# EAGLE design Faceg (EAGLE 6.1)
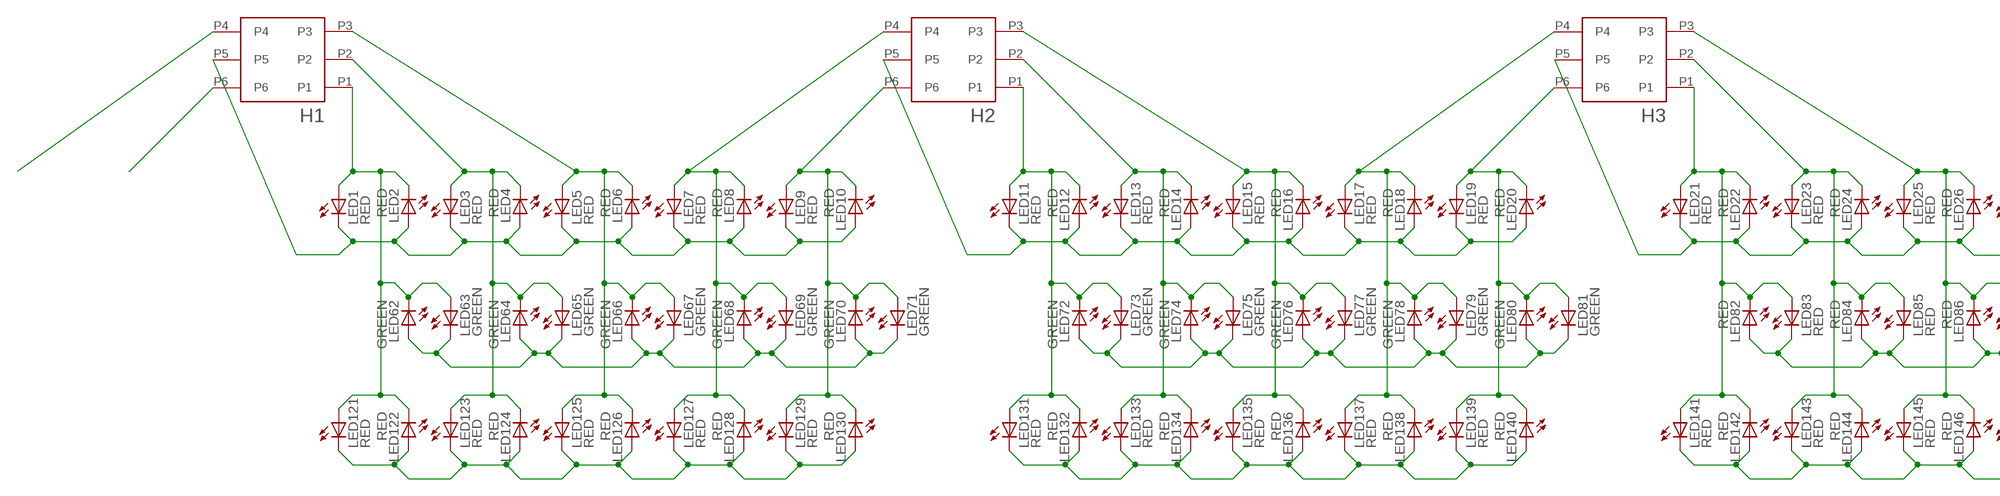
[diagram p0: schematic, sheet 1, part 1 of 2]
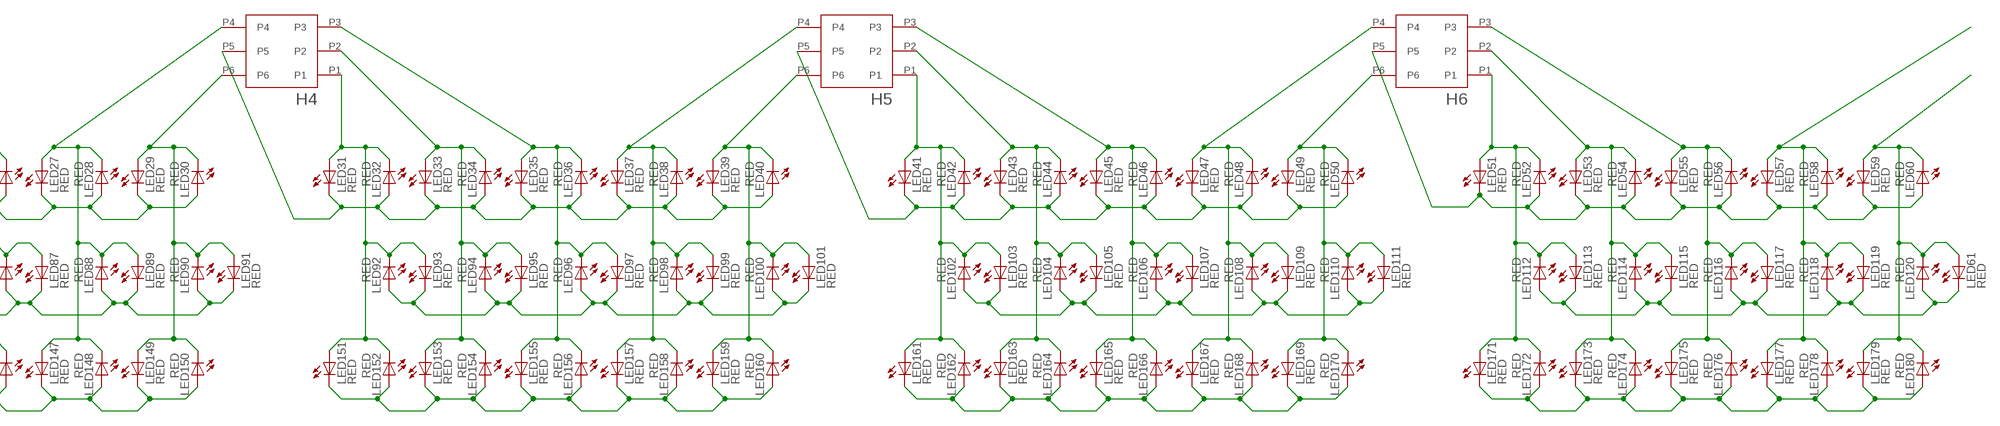
[diagram p1: schematic, sheet 1, part 2 of 2]

## Parts
H1  2X3  [3X2_1MM_SMD]
H2  2X3  [3X2_1MM_SMD]
H3  2X3  [3X2_1MM_SMD]
H4  2X3  [3X2_1MM_SMD]
H5  2X3  [3X2_1MM_SMD]
H6  2X3  [3X2_1MM_SMD]
LED1  RED  LED0603  [LED-0603]
LED2  RED  LED0603  [LED-0603]
LED3  RED  LED0603  [LED-0603]
LED4  RED  LED0603  [LED-0603]
LED5  RED  LED0603  [LED-0603]
LED6  RED  LED0603  [LED-0603]
LED7  RED  LED0603  [LED-0603]
LED8  RED  LED0603  [LED-0603]
LED9  RED  LED0603  [LED-0603]
LED10  RED  LED0603  [LED-0603]
LED11  RED  LED0603  [LED-0603]
LED12  RED  LED0603  [LED-0603]
LED13  RED  LED0603  [LED-0603]
LED14  RED  LED0603  [LED-0603]
LED15  RED  LED0603  [LED-0603]
LED16  RED  LED0603  [LED-0603]
LED17  RED  LED0603  [LED-0603]
LED18  RED  LED0603  [LED-0603]
LED19  RED  LED0603  [LED-0603]
LED20  RED  LED0603  [LED-0603]
LED21  RED  LED0603  [LED-0603]
LED22  RED  LED0603  [LED-0603]
LED23  RED  LED0603  [LED-0603]
LED24  RED  LED0603  [LED-0603]
LED25  RED  LED0603  [LED-0603]
LED26  RED  LED0603  [LED-0603]
LED27  RED  LED0603  [LED-0603]
LED28  RED  LED0603  [LED-0603]
LED29  RED  LED0603  [LED-0603]
LED30  RED  LED0603  [LED-0603]
LED31  RED  LED0603  [LED-0603]
LED32  RED  LED0603  [LED-0603]
LED33  RED  LED0603  [LED-0603]
LED34  RED  LED0603  [LED-0603]
LED35  RED  LED0603  [LED-0603]
LED36  RED  LED0603  [LED-0603]
LED37  RED  LED0603  [LED-0603]
LED38  RED  LED0603  [LED-0603]
LED39  RED  LED0603  [LED-0603]
LED40  RED  LED0603  [LED-0603]
LED41  RED  LED0603  [LED-0603]
LED42  RED  LED0603  [LED-0603]
LED43  RED  LED0603  [LED-0603]
LED44  RED  LED0603  [LED-0603]
LED45  RED  LED0603  [LED-0603]
LED46  RED  LED0603  [LED-0603]
LED47  RED  LED0603  [LED-0603]
LED48  RED  LED0603  [LED-0603]
LED49  RED  LED0603  [LED-0603]
LED50  RED  LED0603  [LED-0603]
LED51  RED  LED0603  [LED-0603]
LED52  RED  LED0603  [LED-0603]
LED53  RED  LED0603  [LED-0603]
LED54  RED  LED0603  [LED-0603]
LED55  RED  LED0603  [LED-0603]
LED56  RED  LED0603  [LED-0603]
LED57  RED  LED0603  [LED-0603]
LED58  RED  LED0603  [LED-0603]
LED59  RED  LED0603  [LED-0603]
LED60  RED  LED0603  [LED-0603]
LED61  RED  LED0603  [LED-0603]
LED62  GREEN  LED0603  [LED-0603]
LED63  GREEN  LED0603  [LED-0603]
LED64  GREEN  LED0603  [LED-0603]
LED65  GREEN  LED0603  [LED-0603]
LED66  GREEN  LED0603  [LED-0603]
LED67  GREEN  LED0603  [LED-0603]
LED68  GREEN  LED0603  [LED-0603]
LED69  GREEN  LED0603  [LED-0603]
LED70  GREEN  LED0603  [LED-0603]
LED71  GREEN  LED0603  [LED-0603]
LED72  GREEN  LED0603  [LED-0603]
LED73  GREEN  LED0603  [LED-0603]
LED74  GREEN  LED0603  [LED-0603]
LED75  GREEN  LED0603  [LED-0603]
LED76  GREEN  LED0603  [LED-0603]
LED77  GREEN  LED0603  [LED-0603]
LED78  GREEN  LED0603  [LED-0603]
LED79  GREEN  LED0603  [LED-0603]
LED80  GREEN  LED0603  [LED-0603]
LED81  GREEN  LED0603  [LED-0603]
LED82  RED  LED0603  [LED-0603]
LED83  RED  LED0603  [LED-0603]
LED84  RED  LED0603  [LED-0603]
LED85  RED  LED0603  [LED-0603]
LED86  RED  LED0603  [LED-0603]
LED87  RED  LED0603  [LED-0603]
LED88  RED  LED0603  [LED-0603]
LED89  RED  LED0603  [LED-0603]
LED90  RED  LED0603  [LED-0603]
LED91  RED  LED0603  [LED-0603]
LED92  RED  LED0603  [LED-0603]
LED93  RED  LED0603  [LED-0603]
LED94  RED  LED0603  [LED-0603]
LED95  RED  LED0603  [LED-0603]
LED96  RED  LED0603  [LED-0603]
LED97  RED  LED0603  [LED-0603]
LED98  RED  LED0603  [LED-0603]
LED99  RED  LED0603  [LED-0603]
LED100  RED  LED0603  [LED-0603]
LED101  RED  LED0603  [LED-0603]
LED102  RED  LED0603  [LED-0603]
LED103  RED  LED0603  [LED-0603]
LED104  RED  LED0603  [LED-0603]
LED105  RED  LED0603  [LED-0603]
LED106  RED  LED0603  [LED-0603]
LED107  RED  LED0603  [LED-0603]
LED108  RED  LED0603  [LED-0603]
LED109  RED  LED0603  [LED-0603]
LED110  RED  LED0603  [LED-0603]
LED111  RED  LED0603  [LED-0603]
LED112  RED  LED0603  [LED-0603]
LED113  RED  LED0603  [LED-0603]
LED114  RED  LED0603  [LED-0603]
LED115  RED  LED0603  [LED-0603]
LED116  RED  LED0603  [LED-0603]
LED117  RED  LED0603  [LED-0603]
LED118  RED  LED0603  [LED-0603]
LED119  RED  LED0603  [LED-0603]
LED120  RED  LED0603  [LED-0603]
LED121  RED  LED0603  [LED-0603]
LED122  RED  LED0603  [LED-0603]
LED123  RED  LED0603  [LED-0603]
LED124  RED  LED0603  [LED-0603]
LED125  RED  LED0603  [LED-0603]
LED126  RED  LED0603  [LED-0603]
LED127  RED  LED0603  [LED-0603]
LED128  RED  LED0603  [LED-0603]
LED129  RED  LED0603  [LED-0603]
LED130  RED  LED0603  [LED-0603]
LED131  RED  LED0603  [LED-0603]
LED132  RED  LED0603  [LED-0603]
LED133  RED  LED0603  [LED-0603]
LED134  RED  LED0603  [LED-0603]
LED135  RED  LED0603  [LED-0603]
LED136  RED  LED0603  [LED-0603]
LED137  RED  LED0603  [LED-0603]
LED138  RED  LED0603  [LED-0603]
LED139  RED  LED0603  [LED-0603]
LED140  RED  LED0603  [LED-0603]
LED141  RED  LED0603  [LED-0603]
LED142  RED  LED0603  [LED-0603]
LED143  RED  LED0603  [LED-0603]
LED144  RED  LED0603  [LED-0603]
LED145  RED  LED0603  [LED-0603]
LED146  RED  LED0603  [LED-0603]
LED147  RED  LED0603  [LED-0603]
LED148  RED  LED0603  [LED-0603]
LED149  RED  LED0603  [LED-0603]
LED150  RED  LED0603  [LED-0603]
LED151  RED  LED0603  [LED-0603]
LED152  RED  LED0603  [LED-0603]
LED153  RED  LED0603  [LED-0603]
LED154  RED  LED0603  [LED-0603]
LED155  RED  LED0603  [LED-0603]
LED156  RED  LED0603  [LED-0603]
LED157  RED  LED0603  [LED-0603]
LED158  RED  LED0603  [LED-0603]
LED159  RED  LED0603  [LED-0603]
LED160  RED  LED0603  [LED-0603]
LED161  RED  LED0603  [LED-0603]
LED162  RED  LED0603  [LED-0603]
LED163  RED  LED0603  [LED-0603]
LED164  RED  LED0603  [LED-0603]
LED165  RED  LED0603  [LED-0603]
LED166  RED  LED0603  [LED-0603]
LED167  RED  LED0603  [LED-0603]
LED168  RED  LED0603  [LED-0603]
LED169  RED  LED0603  [LED-0603]
LED170  RED  LED0603  [LED-0603]
LED171  RED  LED0603  [LED-0603]
LED172  RED  LED0603  [LED-0603]
LED173  RED  LED0603  [LED-0603]
LED174  RED  LED0603  [LED-0603]
LED175  RED  LED0603  [LED-0603]
LED176  RED  LED0603  [LED-0603]
LED177  RED  LED0603  [LED-0603]
LED178  RED  LED0603  [LED-0603]
LED179  RED  LED0603  [LED-0603]
LED180  RED  LED0603  [LED-0603]

## Nets
N$1: H1.P1 LED1.A LED2.C LED62.C LED63.A LED121.A LED122.C
N$2: H1.P2 LED3.A LED4.C LED64.C LED65.A LED123.A LED124.C
N$3: H1.P3 LED5.A LED6.C LED66.C LED67.A LED125.A LED126.C
N$4: H2.P4 LED7.A LED8.C LED68.C LED69.A LED127.A LED128.C
N$5: H2.P6 LED9.A LED10.C LED70.C LED71.A LED129.A LED130.C
N$6: H2.P1 LED11.A LED12.C LED72.C LED73.A LED131.A LED132.C
N$7: H2.P2 LED13.A LED14.C LED74.C LED75.A LED133.A LED134.C
N$8: H2.P3 LED15.A LED16.C LED76.C LED77.A LED135.A LED136.C
N$9: H3.P4 LED17.A LED18.C LED78.C LED79.A LED137.A LED138.C
N$10: H3.P6 LED19.A LED20.C LED80.C LED81.A LED139.A LED140.C
N$11: H3.P1 LED21.A LED22.C LED82.C LED83.A LED141.A LED142.C
N$12: H3.P2 LED23.A LED24.C LED84.C LED85.A LED143.A LED144.C
N$13: H3.P3 LED25.A LED26.C LED86.C LED87.A LED145.A LED146.C
N$14: H4.P4 LED27.A LED28.C LED88.C LED89.A LED147.A LED148.C
N$15: H4.P6 LED29.A LED30.C LED90.C LED91.A LED149.A LED150.C
N$16: H4.P1 LED31.A LED32.C LED92.C LED93.A LED151.A LED152.C
N$17: H4.P2 LED33.A LED34.C LED94.C LED95.A LED153.A LED154.C
N$18: H4.P3 LED35.A LED36.C LED96.C LED97.A LED155.A LED156.C
N$19: H5.P4 LED37.A LED38.C LED98.C LED99.A LED157.A LED158.C
N$20: H5.P6 LED39.A LED40.C LED100.C LED101.A LED159.A LED160.C
N$21: H5.P1 LED41.A LED42.C LED102.C LED103.A LED161.A LED162.C
N$22: H5.P2 LED43.A LED44.C LED104.C LED105.A LED163.A LED164.C
N$23: H5.P3 LED45.A LED46.C LED106.C LED107.A LED165.A LED166.C
N$24: H6.P4 LED47.A LED48.C LED108.C LED109.A LED167.A LED168.C
N$25: H6.P6 LED49.A LED50.C LED110.C LED111.A LED169.A LED170.C
N$26: H6.P1 LED51.A LED52.C LED112.C LED113.A LED171.A LED172.C
N$27: H6.P2 LED53.A LED54.C LED114.C LED115.A LED173.A LED174.C
N$28: H6.P3 LED55.A LED56.C LED116.C LED117.A LED175.A LED176.C
N$29: H1.P4 LED57.A LED58.C LED118.C LED119.A LED177.A LED178.C
N$30: H1.P6 LED59.A LED60.C LED61.A LED120.C LED179.A LED180.C
N$31: LED121.C LED122.A LED123.C LED124.A LED125.C LED126.A LED127.C LED128.A LED129.C LED130.A
N$91: H1.P5 LED1.C LED2.A LED3.C LED4.A LED5.C LED6.A LED7.C LED8.A LED9.C LED10.A
N$96: H2.P5 LED11.C LED12.A LED13.C LED14.A LED15.C LED16.A LED17.C LED18.A LED19.C LED20.A
N$101: H3.P5 LED21.C LED22.A LED23.C LED24.A LED25.C LED26.A LED27.C LED28.A LED29.C LED30.A
N$106: H4.P5 LED31.C LED32.A LED33.C LED34.A LED35.C LED36.A LED37.C LED38.A LED39.C LED40.A
N$111: H5.P5 LED41.C LED42.A LED43.C LED44.A LED45.C LED46.A LED47.C LED48.A LED49.C LED50.A
N$116: H6.P5 LED51.C LED52.A LED53.C LED54.A LED55.C LED56.A LED57.C LED58.A LED59.C LED60.A
N$121: LED62.A LED63.C LED64.A LED65.C LED66.A LED67.C LED68.A LED69.C LED70.A LED71.C
N$126: LED72.A LED73.C LED74.A LED75.C LED76.A LED77.C LED78.A LED79.C LED80.A LED81.C
N$131: LED82.A LED83.C LED84.A LED85.C LED86.A LED87.C LED88.A LED89.C LED90.A LED91.C
N$136: LED92.A LED93.C LED94.A LED95.C LED96.A LED97.C LED98.A LED99.C LED100.A LED101.C
N$141: LED102.A LED103.C LED104.A LED105.C LED106.A LED107.C LED108.A LED109.C LED110.A LED111.C
N$146: LED61.C LED112.A LED113.C LED114.A LED115.C LED116.A LED117.C LED118.A LED119.C LED120.A
N$156: LED131.C LED132.A LED133.C LED134.A LED135.C LED136.A LED137.C LED138.A LED139.C LED140.A
N$161: LED141.C LED142.A LED143.C LED144.A LED145.C LED146.A LED147.C LED148.A LED149.C LED150.A
N$166: LED151.C LED152.A LED153.C LED154.A LED155.C LED156.A LED157.C LED158.A LED159.C LED160.A
N$171: LED161.C LED162.A LED163.C LED164.A LED165.C LED166.A LED167.C LED168.A LED169.C LED170.A
N$176: LED171.C LED172.A LED173.C LED174.A LED175.C LED176.A LED177.C LED178.A LED179.C LED180.A

## Library data of the parts
H1-H6 = Customs:2X3
LED1-LED180 = SparkFun-LED:LED: LEDs Standard schematic elements and footprints for 5mm, 3mm, 1206, and 0603 sized LEDs. 5mm - Spark Fun Electronics SKU : COM-00529 (and others)

## Board
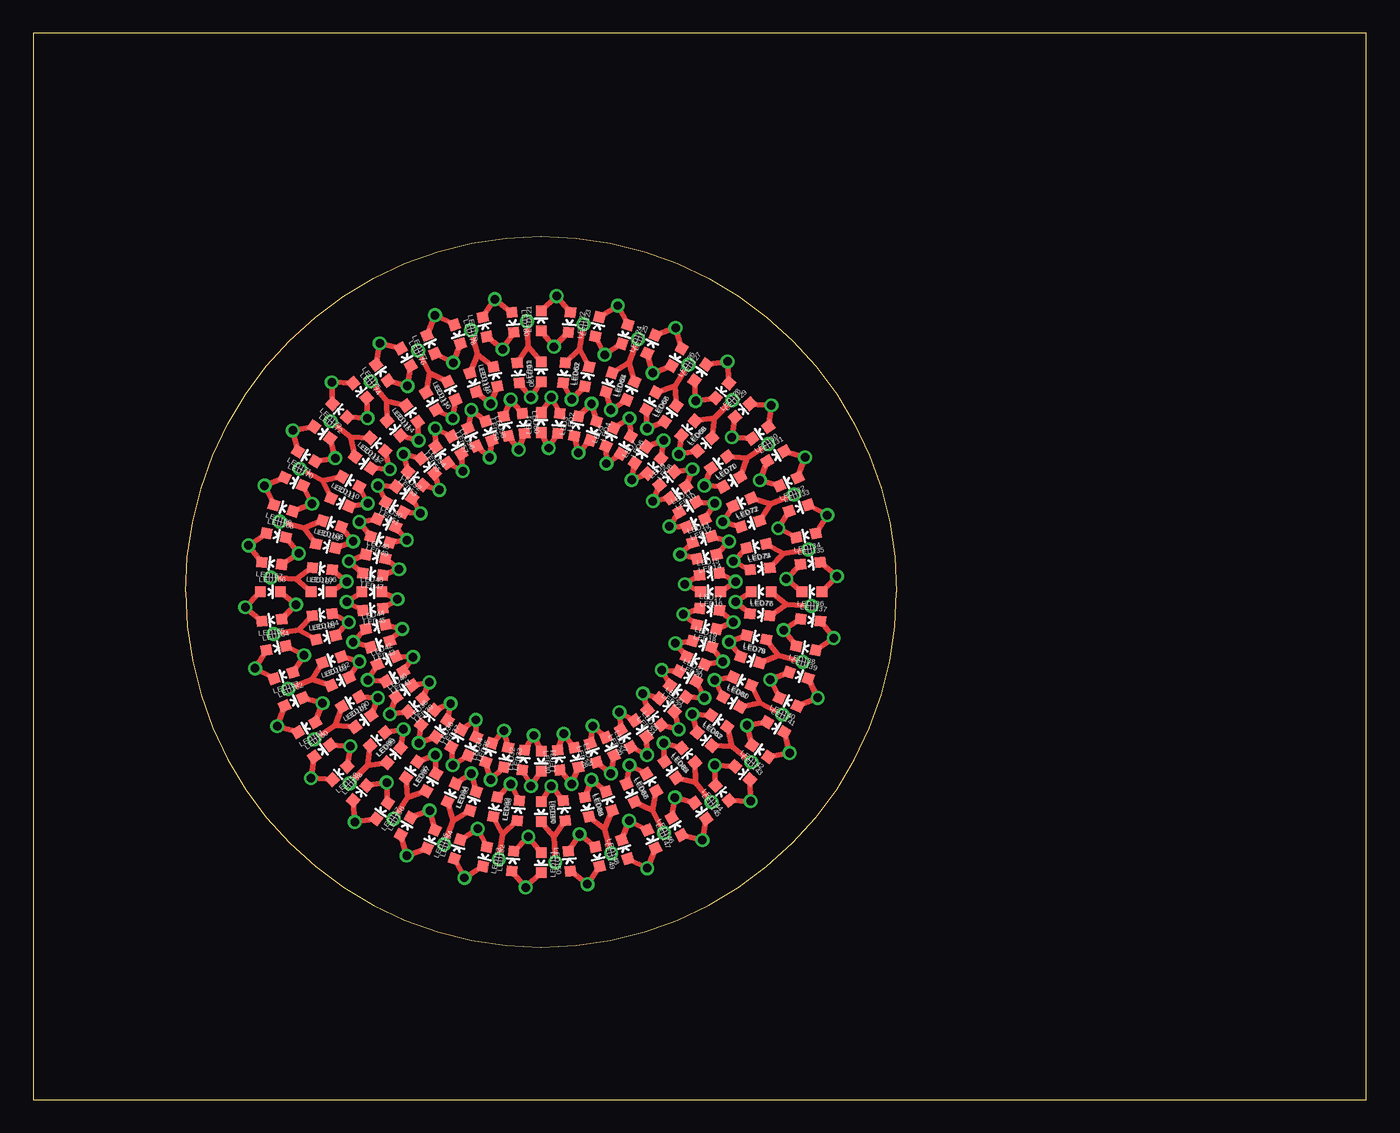
[diagram p2: board, top side]
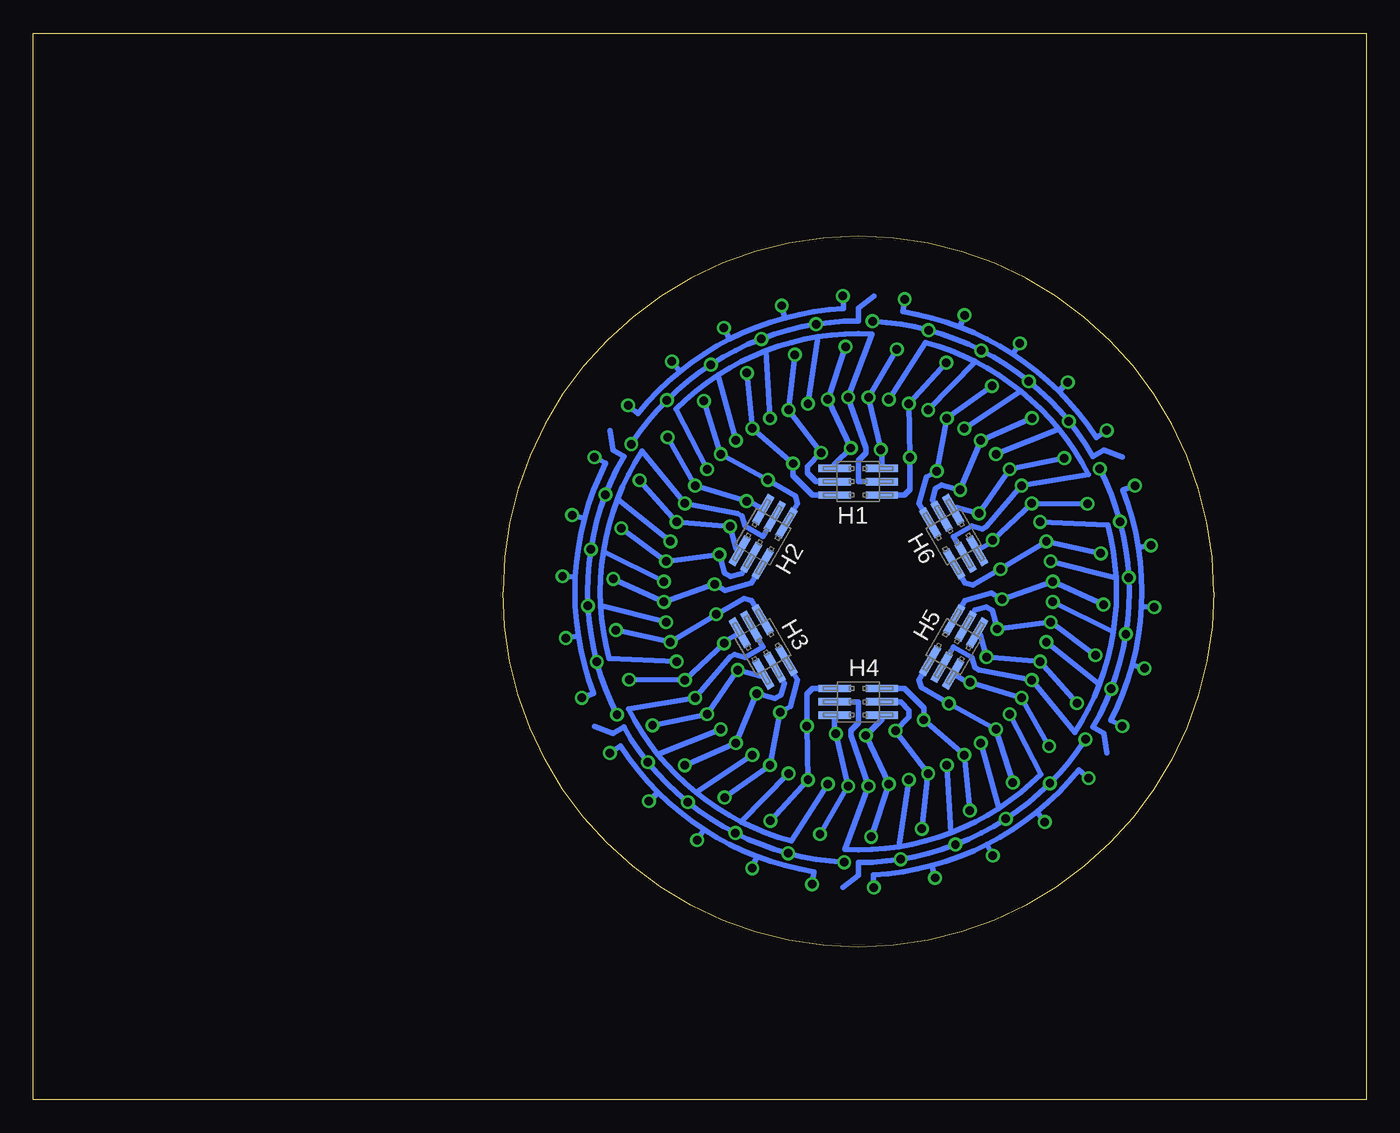
[diagram p3: board, bottom side, seen from below]

Size 100 x 80 mm. Coordinates in mm from the lower left corner, seen from the top.
Outline: 0,0 100,0 100,80 0,80 0,0
Outline: 11.43,38.1 arc180 64.77,38.1 arc180 11.43,38.1
Copper layers (1*16): Top 0.035mm / dielectric 1.5mm / Bottom 0.035mm
Design rules: minimum track width 10mil, minimum drill 24mil, track to track 8mil, track to pad 8mil, pad to pad 8mil, via to via 8mil, smd to smd 8mil, copper to edge 40mil, drill to drill 8mil, minimum pad ring 10mil, minimum via ring 8mil, stop-mask expansion 4mil, vias tented up to drill 0mil, thermal gap 10mil

### Footprints (pad centres in the part's own frame; a part is rotated, then mirrored left to right if it is on the bottom)
3X2_1MM_SMD = smd 2.413 x 0.559: P1 -1.778,1; P2 -1.778,0; P3 -1.778,-1; P4 1.778,-1; P5 1.778,0; P6 1.778,1
LED-0603 = smd 0.8 x 0.8: A 0,-0.75; C 0,0.75

### Placement (x,y rotation side)
H1  38.1,46.35 0 bottom
H2  45.25,42.23 60 bottom
H3  45.25,33.97 120 bottom
H4  38.1,29.85 180 bottom
H5  30.95,33.97 240 bottom
H6  30.95,42.23 300 bottom
LED1  38.1,50.8 0 top
LED2  39.43,50.73 174 top
LED3  40.74,50.52 348 top
LED4  42.02,50.18 162 top
LED5  43.27,49.7 336 top
LED6  44.45,49.1 150 top
LED7  45.56,48.37 324 top
LED8  46.6,47.54 138 top
LED9  47.54,46.6 312 top
LED10  48.37,45.56 126 top
LED11  49.1,44.45 300 top
LED12  49.7,43.27 114 top
LED13  50.18,42.02 288 top
LED14  50.52,40.74 102 top
LED15  50.73,39.43 276 top
LED16  50.8,38.1 90 top
LED17  50.73,36.77 264 top
LED18  50.52,35.46 78 top
LED19  50.18,34.18 252 top
LED20  49.7,32.93 66 top
LED21  49.1,31.75 240 top
LED22  48.37,30.64 54 top
LED23  47.54,29.6 228 top
LED24  46.6,28.66 42 top
LED25  45.56,27.83 216 top
LED26  44.45,27.1 30 top
LED27  43.27,26.5 204 top
LED28  42.02,26.02 18 top
LED29  40.74,25.68 192 top
LED30  39.43,25.47 6 top
LED31  38.1,25.4 180 top
LED32  36.77,25.47 354 top
LED33  35.46,25.68 168 top
LED34  34.18,26.02 342 top
LED35  32.93,26.5 156 top
LED36  31.75,27.1 330 top
LED37  30.64,27.83 144 top
LED38  29.6,28.66 318 top
LED39  28.66,29.6 132 top
LED40  27.83,30.64 306 top
LED41  27.1,31.75 120 top
LED42  26.5,32.93 294 top
LED43  26.02,34.18 108 top
LED44  25.68,35.46 282 top
LED45  25.47,36.77 96 top
LED46  25.4,38.1 270 top
LED47  25.47,39.43 84 top
LED48  25.68,40.74 258 top
LED49  26.02,42.02 72 top
LED50  26.5,43.27 246 top
LED51  27.1,44.45 60 top
LED52  27.83,45.56 234 top
LED53  28.66,46.6 48 top
LED54  29.6,47.54 222 top
LED55  30.64,48.37 36 top
LED56  31.75,49.1 210 top
LED57  32.93,49.7 24 top
LED58  34.18,50.18 198 top
LED59  35.46,50.52 12 top
LED60  36.77,50.73 186 top
LED61  38.1,54.61 0 top
LED62  39.83,54.52 174 top
LED63  41.53,54.25 348 top
LED64  43.2,53.8 162 top
LED65  44.82,53.18 336 top
LED66  46.35,52.4 150 top
LED67  47.8,51.46 324 top
LED68  49.15,50.37 138 top
LED69  50.37,49.15 312 top
LED70  51.46,47.8 126 top
LED71  52.4,46.36 300 top
LED72  53.18,44.82 114 top
LED73  53.8,43.2 288 top
LED74  54.25,41.53 102 top
LED75  54.52,39.83 276 top
LED76  54.61,38.1 90 top
LED77  54.52,36.37 264 top
LED78  54.25,34.67 78 top
LED79  53.8,33 252 top
LED80  53.18,31.38 66 top
LED81  52.4,29.84 240 top
LED82  51.46,28.4 54 top
LED83  50.37,27.05 228 top
LED84  49.15,25.83 42 top
LED85  47.8,24.74 216 top
LED86  46.35,23.8 30 top
LED87  44.82,23.02 204 top
LED88  43.2,22.4 18 top
LED89  41.53,21.95 192 top
LED90  39.83,21.68 6 top
LED91  38.1,21.59 180 top
LED92  36.37,21.68 354 top
LED93  34.67,21.95 168 top
LED94  33,22.4 342 top
LED95  31.38,23.02 156 top
LED96  29.84,23.8 330 top
LED97  28.4,24.74 144 top
LED98  27.05,25.83 318 top
LED99  25.83,27.05 132 top
LED100  24.74,28.4 306 top
LED101  23.8,29.84 120 top
LED102  23.02,31.38 294 top
LED103  22.4,33 108 top
LED104  21.95,34.67 282 top
LED105  21.68,36.37 96 top
LED106  21.59,38.1 270 top
LED107  21.68,39.83 84 top
LED108  21.95,41.53 258 top
LED109  22.4,43.2 72 top
LED110  23.02,44.82 246 top
LED111  23.8,46.36 60 top
LED112  24.74,47.8 234 top
LED113  25.83,49.15 48 top
LED114  27.05,50.37 222 top
LED115  28.4,51.46 36 top
LED116  29.85,52.4 210 top
LED117  31.38,53.18 24 top
LED118  33,53.8 198 top
LED119  34.67,54.25 12 top
LED120  36.37,54.52 186 top
LED121  38.1,58.42 0 top
LED122  40.22,58.31 174 top
LED123  42.32,57.98 348 top
LED124  44.38,57.43 162 top
LED125  46.36,56.66 336 top
LED126  48.26,55.7 150 top
LED127  50.04,54.54 324 top
LED128  51.7,53.2 138 top
LED129  53.2,51.7 312 top
LED130  54.54,50.04 126 top
LED131  55.7,48.26 300 top
LED132  56.66,46.36 114 top
LED133  57.43,44.38 288 top
LED134  57.98,42.32 102 top
LED135  58.31,40.22 276 top
LED136  58.42,38.1 90 top
LED137  58.31,35.98 264 top
LED138  57.98,33.88 78 top
LED139  57.43,31.82 252 top
LED140  56.66,29.84 66 top
LED141  55.7,27.94 240 top
LED142  54.54,26.16 54 top
LED143  53.2,24.5 228 top
LED144  51.7,23 42 top
LED145  50.04,21.66 216 top
LED146  48.26,20.5 30 top
LED147  46.36,19.54 204 top
LED148  44.38,18.77 18 top
LED149  42.32,18.22 192 top
LED150  40.22,17.89 6 top
LED151  38.1,17.78 180 top
LED152  35.98,17.89 354 top
LED153  33.88,18.22 168 top
LED154  31.82,18.77 342 top
LED155  29.84,19.54 156 top
LED156  27.94,20.5 330 top
LED157  26.16,21.66 144 top
LED158  24.5,23 318 top
LED159  23,24.5 132 top
LED160  21.66,26.16 306 top
LED161  20.5,27.94 120 top
LED162  19.54,29.84 294 top
LED163  18.77,31.82 108 top
LED164  18.22,33.88 282 top
LED165  17.89,35.98 96 top
LED166  17.78,38.1 270 top
LED167  17.89,40.22 84 top
LED168  18.22,42.32 258 top
LED169  18.77,44.38 72 top
LED170  19.54,46.36 246 top
LED171  20.5,48.26 60 top
LED172  21.66,50.04 234 top
LED173  23,51.7 48 top
LED174  24.5,53.2 222 top
LED175  26.16,54.54 36 top
LED176  27.94,55.7 210 top
LED177  29.84,56.66 24 top
LED178  31.82,57.43 198 top
LED179  33.88,57.98 12 top
LED180  35.98,58.31 186 top

### Tracks (layer width: path | path; a pad name or v marks a point on that pad's centre or on a via)
N$1  (via drill 0.64)
  Top 0.406: LED63.A v40.38,52.52 LED62.C | LED1.A v38.66,48.88 LED2.C | LED121.A v39.06,56.49 LED122.C
  Bottom 0.406: v39.06,56.49 v40.38,52.52 v38.66,48.88 39.88,47.67 H1.P1
N$2  (via drill 0.64)
  Top 0.406: LED4.C v40.89,48.53 LED3.A | LED124.C v42.87,55.89 LED123.A | LED65.A v43.33,51.73 LED64.C
  Bottom 0.406: v42.87,55.89 v43.33,51.73 v40.89,48.53 41.91,47.51 41.91,46.99 41.27,46.35 H1.P2
N$3  (via drill 0.64)
  Top 0.406: LED5.A v43,47.72 LED6.C | LED125.A v46.46,54.51 LED126.C | LED66.C v46.05,50.35 LED67.A
  Bottom 0.406: v46.46,54.51 v46.05,50.35 v43,47.72 43,46.81 41.55,45.35 H1.P3
N$4  (via drill 0.64)
  Top 0.406: LED7.A v44.89,46.49 LED8.C | LED127.A v49.69,52.41 LED128.C | LED68.C v48.43,48.43 LED69.A
  Bottom 0.406: v49.69,52.41 v48.43,48.43 v44.89,46.49 42.82,45.29 42.66,44.71 H2.P4
N$5  (via drill 0.64)
  Top 0.406: LED9.A v46.49,44.89 LED10.C | LED129.A v52.41,49.69 LED130.C | LED70.C v50.35,46.05 LED71.A
  Bottom 0.406: v52.41,49.69 v50.35,46.05 v46.49,44.89 46.37,44.93 H2.P6
N$6  (via drill 0.64)
  Top 0.406: LED11.A v47.72,43 LED12.C | LED132.C v54.51,46.46 LED131.A | LED72.C v51.73,43.33 LED73.A
  Bottom 0.406: v54.51,46.46 v51.73,43.33 v47.72,43 47.27,41.34 H2.P1
N$7  (via drill 0.64)
  Top 0.406: LED13.A v48.53,40.89 LED14.C | LED133.A v55.89,42.87 LED134.C | LED74.C v52.52,40.38 LED75.A
  Bottom 0.406: v55.89,42.87 v52.52,40.38 v48.53,40.89 48.16,39.51 47.7,39.24 46.84,39.48 H2.P2
N$8  (via drill 0.64)
  Top 0.406: LED15.A v48.88,38.66 LED16.C | LED135.A v56.49,39.06 LED136.C | LED76.C v52.69,37.34 LED77.A
  Bottom 0.406: v56.49,39.06 v52.69,37.34 v48.88,38.66 48.09,38.21 46.11,38.74 H2.P3
N$9  (via drill 0.64)
  Top 0.406: LED17.A v48.76,36.41 LED18.C | LED137.A v56.29,35.22 LED138.C | LED78.C v52.21,34.32 LED79.A
  Bottom 0.406: v56.29,35.22 v52.21,34.32 v48.76,36.41 46.68,37.61 46.11,37.46 H3.P4
N$10  (via drill 0.64)
  Top 0.406: LED19.A v48.18,34.23 LED20.C | LED139.A v55.29,31.5 LED140.C | LED80.C v51.11,31.47 LED81.A
  Bottom 0.406: v55.29,31.5 v51.11,31.47 v48.18,34.23 48.15,34.35 H3.P6
N$11  (via drill 0.64)
  Top 0.406: LED21.A v47.15,32.22 LED22.C | LED141.A v53.54,28.07 LED142.C | LED82.C v49.45,28.91 LED83.A
  Bottom 0.406: v53.54,28.07 v49.45,28.91 v47.15,32.22 45.5,31.78 H3.P1
N$12  (via drill 0.64)
  Top 0.406: LED23.A v45.73,30.47 LED24.C | LED143.A v51.12,25.08 LED144.C | LED84.C v47.29,26.75 LED85.A
  Bottom 0.406: v51.12,25.08 v47.29,26.75 v45.73,30.47 44.34,30.09 43.89,30.36 43.66,31.22 H3.P2
N$13  (via drill 0.64)
  Top 0.406: LED25.A v43.98,29.05 LED26.C | LED145.A v48.13,22.66 LED146.C | LED86.C v44.73,25.09 LED87.A
  Bottom 0.406: v48.13,22.66 v44.73,25.09 v43.98,29.05 43.19,29.5 42.66,31.49 H3.P3
N$14  (via drill 0.64)
  Top 0.406: LED27.A v41.97,28.02 LED28.C | LED147.A v44.7,20.91 LED148.C | LED88.C v41.88,23.99 LED89.A
  Bottom 0.406: v44.7,20.91 v41.88,23.99 v41.97,28.02 41.97,30.42 41.55,30.84 H4.P4
N$15  (via drill 0.64)
  Top 0.406: LED29.A v39.79,27.44 LED30.C | LED149.A v40.98,19.91 LED150.C | LED90.C v38.86,23.52 LED91.A
  Bottom 0.406: v40.98,19.91 v38.86,23.52 v39.79,27.44 39.88,27.53 H4.P6
N$16  (via drill 0.64)
  Top 0.406: LED31.A v37.53,27.32 LED32.C | LED151.A v37.14,19.71 LED152.C | LED92.C v35.81,23.68 LED93.A
  Bottom 0.406: v37.14,19.71 v35.81,23.68 v37.53,27.32 36.32,28.53 H4.P1
N$17  (via drill 0.64)
  Top 0.406: LED33.A v35.31,27.67 LED34.C | LED153.A v33.33,20.31 LED154.C | LED94.C v32.87,24.46 LED95.A
  Bottom 0.406: v33.33,20.31 v32.87,24.46 v35.31,27.67 34.29,28.69 34.29,29.21 34.92,29.84 H4.P2
N$18  (via drill 0.64)
  Top 0.406: LED35.A v33.2,28.48 LED36.C | LED156.C v29.74,21.69 LED155.A | LED96.C v30.15,25.85 LED97.A
  Bottom 0.406: v29.74,21.69 v30.15,25.85 v33.2,28.48 33.2,29.39 34.66,30.84 H4.P3
N$19  (via drill 0.64)
  Top 0.406: LED37.A v31.31,29.71 LED38.C | LED157.A v26.51,23.79 LED158.C | LED98.C v27.77,27.77 LED99.A
  Bottom 0.406: v26.51,23.79 v27.77,27.77 v31.31,29.71 33.38,30.91 33.54,31.49 H5.P4
N$20  (via drill 0.64)
  Top 0.406: LED39.A v29.71,31.31 LED40.C | LED159.A v23.79,26.51 LED160.C | LED100.C v25.85,30.15 LED101.A
  Bottom 0.406: v23.79,26.51 v25.85,30.15 v29.71,31.31 29.83,31.27 H5.P6
N$21  (via drill 0.64)
  Top 0.406: LED41.A v28.48,33.2 LED42.C | LED161.A v21.69,29.74 LED162.C | LED103.A v24.46,32.87 LED102.C
  Bottom 0.406: v21.69,29.74 v24.46,32.87 v28.48,33.2 28.93,34.86 H5.P1
N$22  (via drill 0.64)
  Top 0.406: LED43.A v27.67,35.31 LED44.C | LED164.C v20.31,33.33 LED163.A | LED105.A v23.68,35.81 LED104.C
  Bottom 0.406: v20.31,33.33 v23.68,35.81 v27.67,35.31 28.05,36.69 28.5,36.95 29.36,36.72 H5.P2
N$23  (via drill 0.64)
  Top 0.406: LED46.C v27.32,37.53 LED45.A | LED166.C v19.71,37.14 LED165.A | LED106.C v23.52,38.86 LED107.A
  Bottom 0.406: v19.71,37.14 v23.52,38.86 v27.32,37.53 28.11,37.99 30.09,37.46 H5.P3
N$24  (via drill 0.64)
  Top 0.406: LED48.C v27.44,39.79 LED47.A | LED168.C v19.91,40.98 LED167.A | LED109.A v23.99,41.88 LED108.C
  Bottom 0.406: v19.91,40.98 v23.99,41.88 v27.44,39.79 29.52,38.59 30.09,38.74 H6.P4
N$25  (via drill 0.64)
  Top 0.406: LED50.C v28.02,41.97 LED49.A | LED170.C v20.91,44.7 LED169.A | LED111.A v25.09,44.73 LED110.C
  Bottom 0.406: v20.91,44.7 v25.09,44.73 v28.02,41.97 28.05,41.85 H6.P6
N$26  (via drill 0.64)
  Top 0.406: LED52.C v29.05,43.98 LED51.A | LED172.C v22.66,48.13 LED171.A | LED113.A v26.75,47.29 LED112.C
  Bottom 0.406: v22.66,48.13 v26.75,47.29 v29.05,43.98 30.7,44.42 H6.P1
N$27  (via drill 0.64)
  Top 0.406: LED54.C v30.47,45.73 LED53.A | LED173.A v25.08,51.12 LED174.C | LED115.A v28.91,49.45 LED114.C
  Bottom 0.406: v25.08,51.12 v28.91,49.45 v30.47,45.73 31.86,46.1 32.31,45.84 32.54,44.98 H6.P2
N$28  (via drill 0.64)
  Top 0.406: LED56.C v32.22,47.15 LED55.A | LED176.C v28.07,53.54 LED175.A | LED117.A v31.47,51.11 LED116.C
  Bottom 0.406: v28.07,53.54 v31.47,51.11 v32.22,47.15 33.01,46.7 33.54,44.71 H6.P3
N$29  (via drill 0.64)
  Top 0.406: LED58.C v34.23,48.18 LED57.A | LED178.C v31.5,55.29 LED177.A | LED119.A v34.32,52.21 LED118.C
  Bottom 0.406: v31.5,55.29 v34.32,52.21 v34.23,48.18 34.23,45.78 34.66,45.35 H1.P4
N$30  (via drill 0.64)
  Top 0.406: LED59.A v36.41,48.76 LED60.C | LED180.C v35.22,56.29 LED179.A | LED61.A v37.34,52.69 LED120.C
  Bottom 0.406: v35.22,56.29 v37.34,52.69 v36.41,48.76 36.32,48.67 H1.P6
N$31  (via drill 0.64)
  Top 0.406: LED121.C v39.26,60.3 LED122.A | LED123.C v43.85,59.57 LED124.A | LED126.A v48.19,57.9 LED125.C | LED128.A v52.09,55.37 LED127.C | LED129.C v55.37,52.09 LED130.A
  Bottom 0.406: v39.26,60.3 39.21,59.34 arc-12 43.61,58.65 | v43.85,59.57 43.61,58.65 | v48.19,57.9 47.76,57.05 | v52.09,55.37 51.49,54.63 | v55.37,52.09 54.63,51.49 arc12 51.49,54.63 | 43.61,58.65 arc-12 47.76,57.05 | 51.49,54.63 arc12 47.76,57.05
N$91  (via drill 0.64)
  Top 0.406: LED1.C v38.86,52.69 LED2.A | LED3.C v41.88,52.21 LED4.A | LED5.C v44.73,51.11 LED6.A | LED7.C v47.29,49.45 LED8.A | LED10.A v49.45,47.29 LED9.C
  Bottom 0.406: v41.88,52.21 41.13,57.23 | v44.73,51.11 45.04,56.18 | v47.29,49.45 48.65,54.34 | v49.45,47.29 51.8,51.8 arc12 48.65,54.34 | 41.13,57.23 arc12 37.09,57.44 v38.86,52.69 37.53,48.88 37.53,48.51 38.1,47.94 38.1,46.35 H1.P5 | 45.04,56.18 arc12 41.13,57.23 | 48.65,54.34 arc12 45.04,56.18
N$96  (via drill 0.64)
  Top 0.406: LED11.C v51.11,44.73 LED12.A | LED13.C v52.21,41.88 LED14.A | LED15.C v52.69,38.86 LED16.A | LED17.C v52.52,35.81 LED18.A | LED19.C v51.73,32.87 LED20.A
  Bottom 0.406: v52.21,41.88 56.18,45.04 | v52.69,38.86 57.23,41.13 | v52.52,35.81 57.44,37.09 | v51.73,32.87 56.81,33.09 arc12 57.44,37.09 | 56.18,45.04 arc12 54.34,48.65 v51.11,44.73 47.15,43.98 46.83,43.79 46.62,43.02 45.25,42.23 H2.P5 | 56.18,45.04 arc-12 57.23,41.13 | 57.23,41.13 arc-12 57.44,37.09
N$101  (via drill 0.64)
  Top 0.406: LED21.C v50.35,30.15 LED22.A | LED23.C v48.43,27.77 LED24.A | LED25.C v46.05,25.85 LED26.A | LED27.C v43.33,24.46 LED28.A | LED29.C v40.38,23.68 LED30.A
  Bottom 0.406: v48.43,27.77 53.15,25.91 | v46.05,25.85 50.29,23.05 | v43.33,24.46 46.89,20.84 | v40.38,23.68 43.11,19.39 arc12 46.89,20.84 | 53.15,25.91 arc12 55.36,29.31 v50.35,30.15 47.72,33.2 47.4,33.39 46.62,33.18 45.25,33.97 H3.P5 | 53.15,25.91 arc-12 50.29,23.05 | 50.29,23.05 arc-12 46.89,20.84
N$106  (via drill 0.64)
  Top 0.406: LED31.C v37.34,23.52 LED32.A | LED33.C v34.32,23.99 LED34.A | LED35.C v31.47,25.09 LED36.A | LED38.A v28.91,26.75 LED37.C | LED39.C v26.75,28.91 LED40.A
  Bottom 0.406: v34.32,23.99 35.07,18.97 | v31.47,25.09 31.16,20.02 | v28.91,26.75 27.55,21.86 | v26.75,28.91 24.41,24.41 arc12 27.55,21.86 | 35.07,18.97 arc12 39.11,18.76 v37.34,23.52 38.66,27.32 38.66,27.69 38.1,28.26 38.1,29.84 H4.P5 | 35.07,18.97 arc-12 31.16,20.02 | 31.16,20.02 arc-12 27.55,21.86
N$111  (via drill 0.64)
  Top 0.406: LED41.C v25.09,31.47 LED42.A | LED43.C v23.99,34.32 LED44.A | LED46.A v23.52,37.34 LED45.C | LED48.A v23.68,40.38 LED47.C | LED50.A v24.46,43.33 LED49.C
  Bottom 0.406: v23.99,34.32 20.02,31.16 | v23.52,37.34 18.97,35.07 | v23.68,40.38 18.76,39.11 | v24.46,43.33 19.39,43.11 arc12 18.76,39.11 | 20.02,31.16 arc12 21.86,27.55 v25.09,31.47 29.05,32.22 29.37,32.41 29.58,33.18 30.95,33.97 H5.P5 | 20.02,31.16 arc-12 18.97,35.07 | 18.97,35.07 arc-12 18.76,39.11
N$116  (via drill 0.64)
  Top 0.406: LED52.A v25.85,46.05 LED51.C | LED53.C v27.77,48.43 LED54.A | LED56.A v30.15,50.35 LED55.C | LED58.A v32.87,51.73 LED57.C | LED60.A v35.81,52.52 LED59.C
  Bottom 0.406: v27.77,48.43 23.05,50.29 | v30.15,50.35 25.91,53.15 | v32.87,51.73 29.31,55.36 | v35.81,52.52 33.09,56.81 arc12 29.31,55.36 | 23.05,50.29 arc12 20.84,46.89 v25.85,46.05 28.48,43 28.8,42.81 29.58,43.02 30.95,42.23 H6.P5 | 23.05,50.29 arc-12 25.91,53.15 | 25.91,53.15 arc-12 29.31,55.36
N$121  (via drill 0.64)
  Top 0.406: LED63.C 40.98,56.29 | LED62.A 40.98,56.29 | 44.7,55.29 LED64.A | LED65.C 44.7,55.29 | LED66.A 48.13,53.54 | LED67.C 48.13,53.54 | LED68.A 51.12,51.12 | LED69.C 51.12,51.12 | LED70.A 53.54,48.13 | LED71.C 53.54,48.13 | 40.98,56.29 v41.28,58.17 | 44.7,55.29 v45.38,57.07 | 48.13,53.54 v49.17,55.14 | 51.12,51.12 v52.47,52.47 | 53.54,48.13 v55.14,49.17
  Bottom 0.406: v55.14,49.17 arc12 v52.47,52.47 arc12 v49.17,55.14 arc12 v45.38,57.07 arc12 v41.28,58.17 arc9 38.1,58.42 38.1,59.37 36.94,60.3
N$126  (via drill 0.64)
  Top 0.406: 55.29,44.7 LED72.A | LED73.C 55.29,44.7 | LED74.A 56.29,40.98 | LED75.C 56.29,40.98 | 56.49,37.14 LED76.A | LED77.C 56.49,37.14 | LED78.A 55.89,33.33 | LED79.C 55.89,33.33 | 54.51,29.74 LED80.A | LED81.C 54.51,29.74 | 55.29,44.7 v57.07,45.38 | 56.29,40.98 v58.17,41.28 | 56.49,37.14 v58.39,37.04 | 55.89,33.33 v57.73,32.84 | 54.51,29.74 v56.2,28.88
  Bottom 0.406: v56.2,28.88 arc12 v57.73,32.84 arc12 v58.39,37.04 arc12 v58.17,41.28 arc12 v57.07,45.38 arc9 55.7,48.26 56.52,48.74 56.74,50.2
N$131  (via drill 0.64)
  Top 0.406: 52.41,26.51 LED82.A | LED83.C 52.41,26.51 | 49.69,23.79 LED84.A | LED85.C 49.69,23.79 | 46.46,21.69 LED86.A | LED87.C 46.46,21.69 | 42.87,20.31 LED88.A | LED89.C 42.87,20.31 | 39.06,19.71 LED90.A | LED91.C 39.06,19.71 | 52.41,26.51 v53.89,25.31 | 49.69,23.79 v50.89,22.31 | 46.46,21.69 v47.33,20 | 42.87,20.31 v43.36,18.47 | 39.06,19.71 v39.16,17.81
  Bottom 0.406: v39.16,17.81 arc12 v43.36,18.47 arc12 v47.33,20 arc12 v50.89,22.31 arc12 v53.89,25.31 arc9 55.7,27.94 56.52,27.46 57.9,28.01
N$136  (via drill 0.64)
  Top 0.406: 35.22,19.91 LED92.A | LED93.C 35.22,19.91 | 31.5,20.91 LED94.A | LED95.C 31.5,20.91 | 28.07,22.66 LED96.A | LED97.C 28.07,22.66 | 25.08,25.08 LED98.A | LED99.C 25.08,25.08 | 22.66,28.07 LED100.A | LED101.C 22.66,28.07 | 35.22,19.91 v34.92,18.03 | v30.82,19.13 31.5,20.91 | v27.03,21.06 28.07,22.66 | v23.73,23.73 25.08,25.08 | v21.06,27.03 22.66,28.07
  Bottom 0.406: v21.06,27.03 arc12 v23.73,23.73 arc12 v27.03,21.06 arc12 v30.82,19.13 arc12 v34.92,18.03 arc9 38.1,17.78 38.1,16.83 39.26,15.9
N$141  (via drill 0.64)
  Top 0.406: 20.91,31.5 LED102.A | LED103.C 20.91,31.5 | 19.91,35.22 LED105.C | LED104.A 19.91,35.22 | 19.71,39.06 LED106.A | LED107.C 19.71,39.06 | 20.31,42.87 LED109.C | LED108.A 20.31,42.87 | 21.69,46.46 LED111.C | LED110.A 21.69,46.46 | 20.91,31.5 v19.13,30.82 | v18.03,34.92 19.91,35.22 | v17.81,39.16 19.71,39.06 | v18.47,43.36 20.31,42.87 | v20,47.33 21.69,46.46
  Bottom 0.406: v20,47.33 arc12 v18.47,43.36 arc12 v17.81,39.16 arc12 v18.03,34.92 arc12 v19.13,30.82 arc9 20.5,27.94 19.68,27.46 19.46,26
N$146  (via drill 0.64)
  Top 0.406: LED113.C 23.79,49.69 | LED112.A 23.79,49.69 | 26.51,52.41 LED115.C | LED114.A 26.51,52.41 | 29.74,54.51 LED117.C | LED116.A 29.74,54.51 | LED119.C 33.33,55.89 | LED118.A 33.33,55.89 | LED61.C 37.14,56.49 | LED120.A 37.14,56.49 | 23.79,49.69 v22.31,50.89 | v25.31,53.89 26.51,52.41 | v28.88,56.2 29.74,54.51 | v32.84,57.73 33.33,55.89 | v37.04,58.39 37.14,56.49
  Bottom 0.406: v37.04,58.39 arc12 v32.84,57.73 arc12 v28.88,56.2 arc12 v25.31,53.89 arc12 v22.31,50.89 arc9 20.5,48.26 19.68,48.74 18.3,48.19
N$156  (via drill 0.64)
  Top 0.406: LED131.C v57.9,48.19 LED132.A | LED133.C v59.57,43.85 LED134.A | LED135.C v60.3,39.26 LED136.A | LED137.C v60.05,34.62 LED138.A | LED139.C v58.85,30.14 LED140.A
  Bottom 0.406: v57.9,48.19 57.05,47.76 arc-12 58.65,43.61 | 58.65,43.61 arc-12 59.34,39.21 | 59.34,39.21 arc-12 59.11,34.77 | 59.11,34.77 arc-12 57.96,30.48 v58.85,30.14 | 59.11,34.77 v60.05,34.62 | 59.34,39.21 v60.3,39.26 | 58.65,43.61 v59.57,43.85
N$161  (via drill 0.64)
  Top 0.406: LED141.C v56.74,26 LED142.A | LED143.C v53.81,22.39 LED144.A | LED145.C v50.2,19.46 LED146.A | LED147.C v46.06,17.35 LED148.A | LED149.C v41.58,16.15 LED150.A
  Bottom 0.406: v41.58,16.15 41.43,17.09 arc12 45.72,18.24 | v46.06,17.35 45.72,18.24 | v50.2,19.46 49.69,20.26 | v53.81,22.39 53.14,23.06 | v56.74,26 55.94,26.51 arc-12 53.14,23.06 | 45.72,18.24 arc12 49.69,20.26 | 49.69,20.26 arc12 53.14,23.06
N$166  (via drill 0.64)
  Top 0.406: LED151.C v36.94,15.9 LED152.A | LED153.C v32.35,16.63 LED154.A | LED155.C v28.01,18.3 LED156.A | LED157.C v24.11,20.83 LED158.A | LED160.A v20.83,24.11 LED159.C
  Bottom 0.406: v20.83,24.11 21.57,24.71 arc12 24.71,21.57 | v24.11,20.83 24.71,21.57 | v28.01,18.3 28.44,19.15 | v32.35,16.63 32.59,17.55 | v36.94,15.9 36.99,16.86 arc-12 32.59,17.55 | 24.71,21.57 arc12 28.44,19.15 | 28.44,19.15 arc12 32.59,17.55
N$171  (via drill 0.64)
  Top 0.406: LED162.A v18.3,28.01 LED161.C | LED163.C v16.63,32.35 LED164.A | LED166.A v15.9,36.94 LED165.C | LED168.A v16.15,41.58 LED167.C | LED170.A v17.35,46.06 LED169.C
  Bottom 0.406: v17.35,46.06 18.24,45.72 arc12 17.09,41.43 | v16.15,41.58 17.09,41.43 | v15.9,36.94 16.86,36.99 | v16.63,32.35 17.55,32.59 | v18.3,28.01 19.15,28.44 arc-12 17.55,32.59 | 17.55,32.59 arc-12 16.86,36.99 | 16.86,36.99 arc-12 17.09,41.43
N$176  (via drill 0.64)
  Top 0.406: LED172.A v19.46,50.2 LED171.C | LED174.A v22.39,53.81 LED173.C | LED176.A v26,56.74 LED175.C | LED178.A v30.14,58.85 LED177.C | LED180.A v34.62,60.05 LED179.C
  Bottom 0.406: v19.46,50.2 20.26,49.69 arc-12 23.06,53.14 | v22.39,53.81 23.06,53.14 | v26,56.74 26.51,55.94 | v30.14,58.85 30.48,57.96 | v34.62,60.05 34.77,59.11 arc12 30.48,57.96 | 26.51,55.94 arc-12 30.48,57.96 | 26.51,55.94 arc12 23.06,53.14